# EAGLE design Qwiic Proximity Sensor - VCNL4040 (EAGLE 9.1.0)
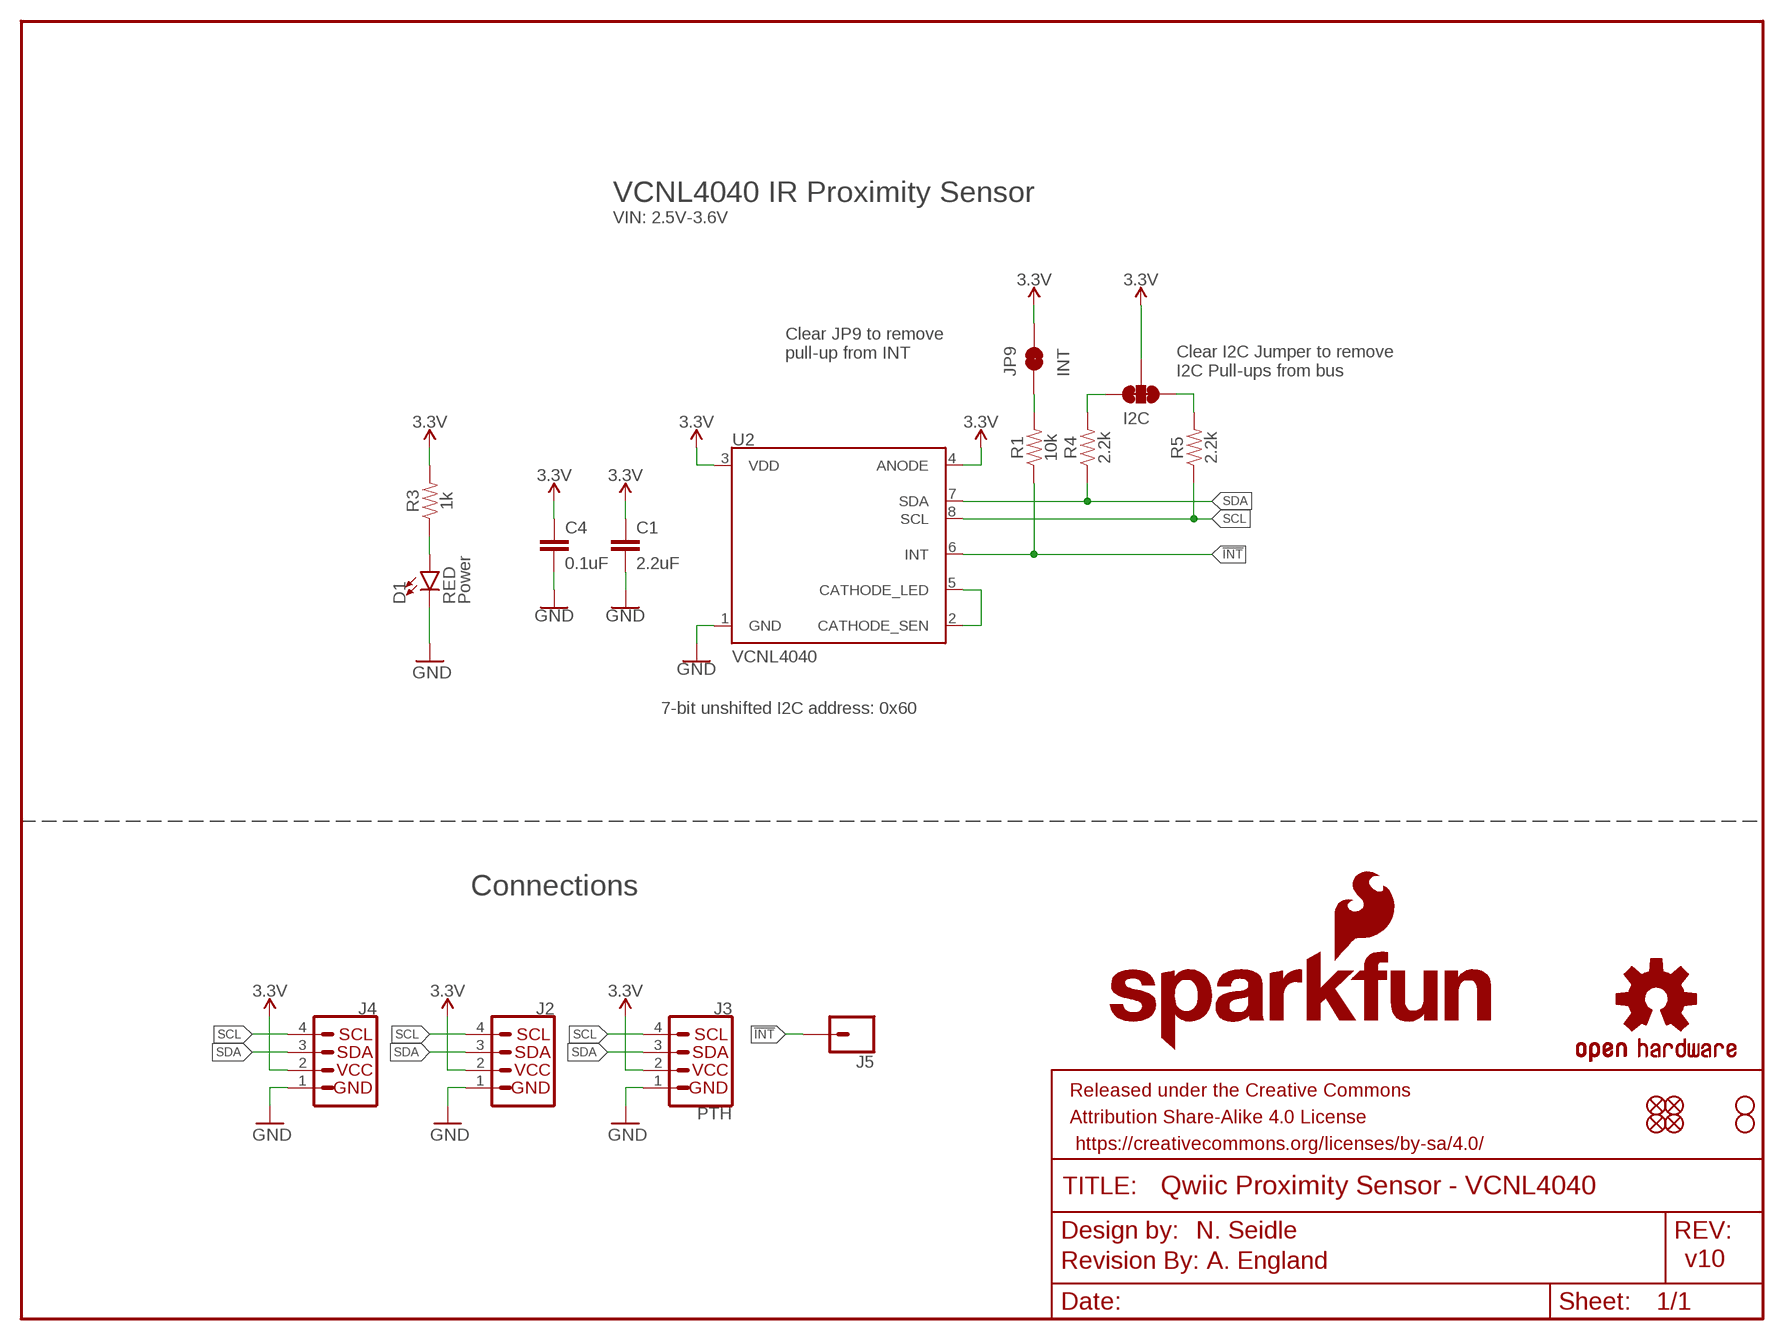
[diagram p0: schematic, sheet 1]

## Parts
C1  2.2uF  2.2UF-0603-10V-20%  [0603]
C4  0.1uF  0.1UF-0603-25V-(+80/-20%)  [0603]
D1  RED  LED-RED0603  [LED-0603]
FRAME1  FRAME-LETTER  [CREATIVE_COMMONS]
I2C  JUMPER-SMT_3_2-NC_TRACE_SILK  [SMT-JUMPER_3_2-NC_TRACE_SILK]
J2  QWIIC_CONNECTORJS-1MM  [1X04_1MM_RA]
J3  PTH  I2C_STANDARD_NO_SILK  [1X04_NO_SILK]
J4  QWIIC_CONNECTORJS-1MM  [1X04_1MM_RA]
J5  CONN_01PTH_NO_SILK_YES_STOP  [1X01_NO_SILK]
JP1  FIDUCIALUFIDUCIAL  [MICRO-FIDUCIAL]
JP2  FIDUCIALUFIDUCIAL  [MICRO-FIDUCIAL]
JP3  STAND-OFF  [STAND-OFF]
JP4  STAND-OFF  [STAND-OFF]
JP5  FIDUCIALUFIDUCIAL  [MICRO-FIDUCIAL]
JP6  FIDUCIALUFIDUCIAL  [MICRO-FIDUCIAL]
JP9  INT  JUMPER-PAD-2-NC_BY_TRACE  [PAD-JUMPER-2-NC_BY_TRACE_YES_SILK]
LOGO1  OSHW-LOGOMINI  [OSHW-LOGO-MINI]
LOGO2  REVISION  [REVISION]
R1  10k  10KOHM-0603-1/10W-1%  [0603]
R3  1k  1KOHM-0603-1/10W-1%  [0603]
R4  2.2k  2.2KOHM-0603-1/10W-1%  [0603]
R5  2.2k  2.2KOHM-0603-1/10W-1%  [0603]
U2  VCNL4040  [SPARKX_VCNL4040]
U$1  SFE_LOGO_NAME_FLAME.1_INCH  [SFE_LOGO_NAME_FLAME_.1]
U$2  SFE_LOGO_NAME_FLAME.1_INCH  [SFE_LOGO_NAME_FLAME_.1]

## Nets
3.3V: C1.1 C4.1 I2C.2 J2.2 J3.2(VCC) J4.2 JP9.2 R3.2 U2.3(VDD) U2.4(ANODE)
!INT: J5.1 R1.1 U2.6(INT)
GND: C1.2 C4.2 D1.C J2.1 J3.1(GND) J4.1 U2.1(GND)
N$1: I2C.1 R5.2
N$2: I2C.3 R4.2
N$3: D1.A R3.1
N$4: JP9.1 R1.2
N$6: U2.2(CATHODE_SEN) U2.5(CATHODE_LED)
SCL: J2.4 J3.4(SCL) J4.4 R5.1 U2.8(SCL)
SDA: J2.3 J3.3(SDA) J4.3 R4.1 U2.7(SDA)

## Notes on the sheet
- VCNL4040 IR Proximity Sensor
- VIN: 2.5V-3.6V
- Clear JP9 to remove 
  pull-up from INT
- Clear I2C Jumper to remove 
  I2C Pull-ups from bus
- Power
- 7-bit unshifted I2C address: 0x60
- Connections
- N. Seidle
- A. England | v10

## Library data of the parts
C1 = SparkFun-Capacitors:2.2UF: 2.2µF ceramic capacitors A capacitor is a passive two-terminal electrical component used to store electrical energy temporarily in an electric field.; PROD_ID: CAP-07888
C4 = SparkFun-Capacitors:0.1UF: 0.1µF ceramic capacitors A capacitor is a passive two-terminal electrical component used to store electrical energy temporarily in an electric field.; PROD_ID: CAP-00810
D1 = SparkFun-LED:LED-RED: Red SMD LED Used in manufacturing of most products at SparkFun Packages: 0603 - SMD 0603 package [Product Link] <http://docs.avagotech.com/docs/AV02-0551EN> 0603 SMART - SMD 0603 SMART package ( more efficient and expensive)[Product Link] <http://www.osram-os.com/Graphics/XPic2/00077099_0.pdf> 1206 - SMD1206 package [Product Link] <https://www.sparkfun.com/datasheets/DevTools/LilyPad/Q150OVS4.pdff> SparkFun Products: Pro Mini 328 -5V <https://www.sparkfun.com/products/821> RedBoard <https://www.sparkfun.com/products/12757> IOIO-OTG <https://www.sparkfun.com/products/13613>; PROD_ID: DIO-00819
FRAME1 = SparkFun-Aesthetics:FRAME-LETTER: Schematic Frame - Letter Standard 8.5x11 US Letter frame
I2C = SparkFun-Jumpers:JUMPER-SMT_3_2-NC_TRACE: Normally closed trace jumper (2 of 2 connections) This jumper has a trace between all three pads so they are normally closed (NC). Use a razor knife to open the connection(s). For best results follow the IPC guidelines for cutting traces: Cutout at least 0.063 mm (0.005 in). Remove all loose material to clean up the cut area. Seal the cut with an approved epoxy. Reapply solder to reclose the connection(s).
J2 J4 = SparkFun-Connectors:QWIIC_CONNECTOR: SparkFun I2C Standard Qwiic Connector An SMD 1mm pitch JST connector makes it easy and quick (get it? Qwiic?) to connect I2C devices to each other. The Qwiic system <http://www.sparkfun.com/qwiic> enables fast and solderless connection between popular platforms and various sensors and actuators. We carry 200mm <https://www.sparkfun.com/products/14204>, 100mm <https://www.sparkfun.com/products/14205>, 50mm <https://www.sparkfun.com/products/14206>, and breadboard friendly <https://www.sparkfun.com/products/14207> Qwiic cables. We also offer 10 pcs strips <https://www.sparkfun.com/products/14323> the SMD connectors.; PROD_ID: CONN-13694
J3 = SparkX:I2C_STANDARD: SparkFun I2C Standard Pinout Header SparkFun has standardized on a pinout for all I2C based sensor breakouts. This pinout allows I2C boards to be plugged directly into the headers on Arduino Uno compatible boards, and to be daisy chained easily. Example SparkFun Products: SparkFun Atmospheric Sensor Breakout - BME280 <https://www.sparkfun.com/products/13676> SparkFun Altitude/Pressure Sensor Breakout - MPL3115A2 <https://www.sparkfun.com/products/11084> SparkFun TOF Range Finder Sensor - VL6180 <https://www.sparkfun.com/products/12785>
J5 = SparkFun-Connectors:CONN_01: Single connection point. Often used as Generic Header-pin footprint for 0.1 inch spaced/style header connections On any of the 0.1 inch spaced packages, you can populate with these: Break Away Headers - Straight <https://www.sparkfun.com/products/116> (PRT-00116) Break Away Male Headers - Right Angle <https://www.sparkfun.com/products/553> (PRT-00553) Female Headers <https://www.sparkfun.com/products/115> (PRT-00115) Break Away Headers - Machine Pin <https://www.sparkfun.com/products/117> (PRT-00117) Break Away Female Headers - Swiss Machine Pin <https://www.sparkfun.com/products/743> (PRT-00743) This device is also useful as a general connection point to wire up your design to another part of your project. Our various solder wires solder well into these plated through hole pads. Hook-Up Wire - Assortment (Stranded, 22 AWG) <https://www.sparkfun.com/products/11375> (PRT-11375) Hook-Up Wire - Assortment (Solid Core, 22 AWG) <https://www.sparkfun.com/products/11367> (PRT-11367) View the entire wire category on our website here <https://www.sparkfun.com/categories/141> Special notes: SMTSO-256-ET is a "flush mount" nut for a 4-40 screw. We mostly use this on specialty testbeds; it is a nice way to connect hardware to your PCB at an adjustable hieght. Also note, the SNAP packages are for using a snappable style connector. We sell a baggie of snaps and they are also used on two LilyPad designs: Snap Assortment - 30 pack (male and female) <https://www.sparkfun.com/products/11347> (DEV-11347) LilyPad Arduino SimpleSnap <https://www.sparkfun.com/products/10941> (DEV-10941) LilyPad SimpleSnap Protoboard <https://www.sparkfun.com/products/10940> (DEV-10940)
JP1 JP2 JP5 JP6 = SparkFun:FIDUCIAL: Fiducial Alignment Points Various fiducial points for machine vision alignment.
JP3 JP4 = SparkFun:STAND-OFF: Stand Off This is the mechanical footprint for a #4 phillips button head screw. Use the keepout ring to avoid running the screw head into surrounding components. SKU : PRT-00447
JP9 = SparkFun-Passives:JUMPER-PAD-2-NC_BY_TRACE
LOGO1 = SparkFun-Aesthetics:OSHW-LOGO: Open-Source Hardware (OSHW) Logo This logo indicates the piece of hardware it is found on incorporates a OSHW license and/or adheres to the definition of open source hardware found here: http://freedomdefined.org/OSHW
LOGO2 = SparkFun-Aesthetics:REVISION: "Revision By" Text Preceding text for revisor documentation. Includes schematic text on "symbols" layer, and board text on tDoc.
R1 = SparkFun-Resistors:10KOHM: 10kΩ resistor A resistor is a passive two-terminal electrical component that implements electrical resistance as a circuit element. Resistors act to reduce current flow, and, at the same time, act to lower voltage levels within circuits. - Wikipedia; PROD_ID: RES-00824
R3 = SparkFun-Resistors:1KOHM: 1kΩ resistor A resistor is a passive two-terminal electrical component that implements electrical resistance as a circuit element. Resistors act to reduce current flow, and, at the same time, act to lower voltage levels within circuits. - Wikipedia; PROD_ID: RES-07856
R4 R5 = SparkFun-Resistors:2.2KOHM: 2.2kΩ resistor A resistor is a passive two-terminal electrical component that implements electrical resistance as a circuit element. Resistors act to reduce current flow, and, at the same time, act to lower voltage levels within circuits. - Wikipedia; PROD_ID: RES-08272
U2 = SparkFun-Sensors:VCNL4040: Vishay VCNL4040 Human Presence sensor A presence sensor with a range of 20 cm. VCNL4040 integrates a proximity sensor (PS), ambient light sensor (ALS), and a high power IRED into one small package.; PROD_ID: IC-14227
U$1 U$2 = SparkFun-Aesthetics:SFE_LOGO_NAME_FLAME: SparkFun Font Logo w/ Flame This is the SparkFun full logo. The logo on the schematic will always be the same size; the package variant is the height of the flame part of the logo. Default layer for the logo on the board is tSilk.

## Net classes
1 power: width 0.203 mm

## Board
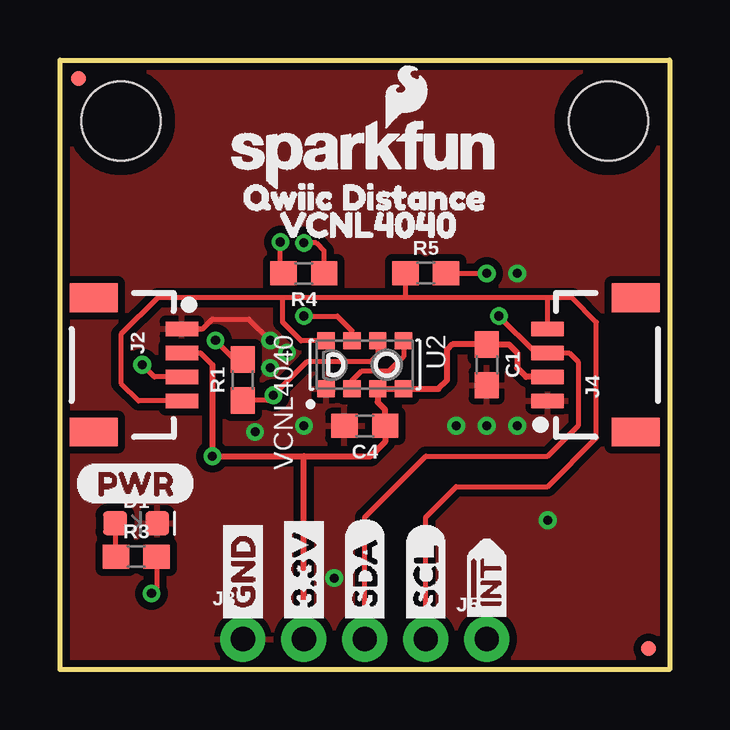
[diagram p1: board, top side]
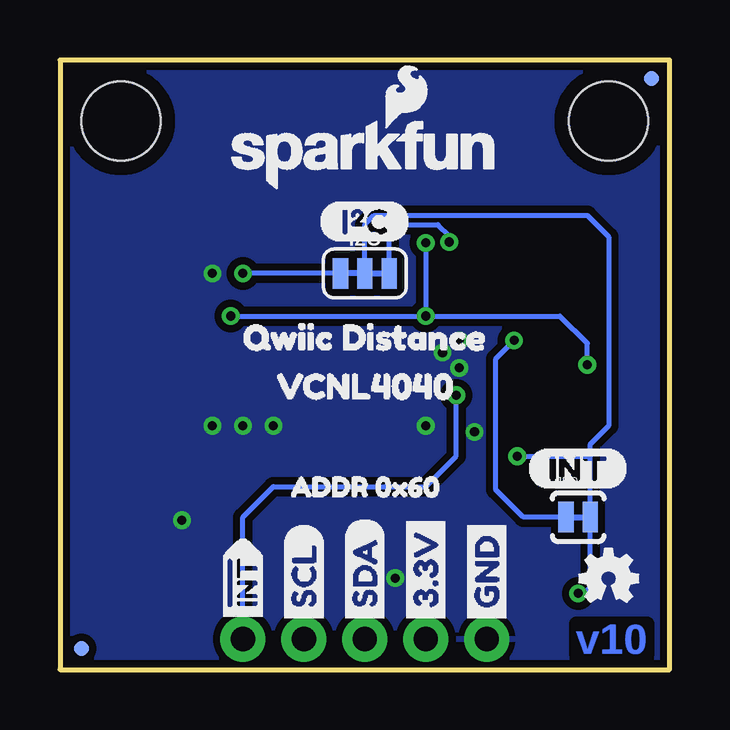
[diagram p2: board, bottom side, seen from below]

Size 25.4 x 25.4 mm. Coordinates in mm from the lower left corner, seen from the top.
Outline: 0,0 0,25.4 25.4,25.4 25.4,0 0,0
Copper layers (1*16): Top 0.035mm / dielectric 1.5mm / Bottom 0.035mm
Design rules "SparkFun-2-layer-TIGHT": minimum track width 7mil, minimum drill 15mil, track to track 7mil, track to pad 7mil, pad to pad 7mil, via to via 7mil, smd to smd 7mil, copper to edge 7mil, drill to drill 7mil, minimum pad ring 7mil, minimum via ring 7mil, stop-mask expansion 4mil, vias tented up to drill 25mil, thermal gap 10mil

### Footprints (pad centres in the part's own frame; a part is rotated, then mirrored left to right if it is on the bottom)
0603 = smd 1.1 x 1: 1 -0.85,0; 2 0.85,0
LED-0603 = smd 1 x 1: A -0.877,0; C 0.877,0
SMT-JUMPER_3_2-NC_TRACE_SILK = smd 0.635 x 1.27: 1 -1.016,0; 2 0,0; 3 1.016,0
1X04_1MM_RA = smd 0.6 x 1.35: 1 -1.5,0; 2 -0.5,0; 3 0.5,0; 4 1.5,0 | smd 1.2 x 2: NC1 2.8,-3.675; NC2 -2.8,-3.675
1X04_NO_SILK = drill 1.016 pad 1.88: 1 0,0; 2 2.54,0; 3 5.08,0; 4 7.62,0
1X01_NO_SILK = drill 1.016 pad 1.88: 1 0,0
MICRO-FIDUCIAL = smd 0.635 x 0.635: 1 0,0
STAND-OFF = hole 3.302: 0,0
PAD-JUMPER-2-NC_BY_TRACE_YES_SILK = smd 0.635 x 1.27: 1 -0.508,0; 2 0.508,0
SPARKX_VCNL4040 = smd 0.7 x 0.725: 1 1,-1.613; 2 1,-0.537; 3 1,0.537; 4 1,1.613; 5 -1,1.613; 6 -1,0.537; 7 -1,-0.537; 8 -1,-1.613

### Placement (x,y rotation side)
C1  17.78,12.7 270 top
C4  12.7,10.16 180 top
D1  3.17,6.1 0 top
FRAME1  -20.32,-17.78 0 top  (outside the outline)
I2C  12.7,16.51 0 bottom
J2  5.08,12.7 270 top
J3  7.62,1.27 0 top
J4  20.32,12.7 90 top
J5  17.78,1.27 0 top
JP1  0.76,24.64 0 bottom
JP2  24.51,0.89 0 top
JP3  2.54,22.86 0 top
JP4  22.86,22.86 0 top
JP5  24.51,0.89 0 bottom
JP6  0.76,24.64 0 top
JP9  3.81,6.35 0 bottom
LOGO1  2.54,3.81 0 bottom
LOGO2  -8.89,-20.32 0 top  (outside the outline)
R1  7.62,12.06 90 top
R3  3.17,4.7 0 top
R4  10.16,16.51 180 top
R5  15.24,16.51 0 top
U2  12.7,12.7 270 top
U$1  12.7,21.46 0 top
U$2  12.7,21.46 0 bottom
U$3  [GND1]  7.62,1.65 90 bottom
U$4  [3#3V2]  10.16,1.65 90 bottom
U$5  [SDA8]  12.7,1.65 90 bottom
U$6  [SCL9]  15.24,1.65 90 bottom
U$7  [#INT14]  17.78,1.52 90 bottom
U$8  [ADDR_0X600]  16.51,7.62 0 bottom
U$10  [(PWR)]  0.64,7.75 0 top
U$11  [(I_SUPER2_C)]  14.61,18.67 0 bottom
U$12  [(INT)]  5.97,8.38 0 bottom
U$13  [VCNL40401]  8.26,18.54 0 top
U$14  [VCNL40401]  17.27,11.81 0 bottom
U$15  [QWIIC_DISTANCE0]  18.67,13.84 0 bottom
U$19  [QWIIC_DISTANCE0]  6.73,19.68 0 top
U$21  [3#3V2]  10.16,1.65 90 top
U$22  [GND1]  7.62,1.65 90 top
U$25  [#INT14]  17.78,1.52 90 top
U$26  [SCL9]  15.24,1.65 90 top
U$27  [SDA8]  12.7,1.65 90 top

### Tracks (layer width: path | path; a pad name or v marks a point on that pad's centre or on a via)
3.3V  (via drill 0.38)
  Top 0.203: J2.2 5.85,13.2 6.35,12.7 | R3.2 4.03,3.39 v3.81,3.17
  Top 0.254: J4.2 19.42,12.2 19.05,12.57 19.05,13.21 18.71,13.55 C1.1 16.34,13.55 16.13,13.34 16.13,12.06 15.76,11.7 U2.4 U2.3 13.24,11.15 13.55,10.83 C4.1 13.55,9.49 12.95,8.89 10.16,8.89 | 6.35,12.7 v6.35,8.89 10.16,8.89 | J3.2 10.16,8.89
  Bottom 0.203: 3.3,8.89 JP9.2 3.3,3.43 3.56,3.17 v3.81,3.17 | 3.3,8.89 3.3,9.4 2.54,10.16 2.54,18.03 3.43,18.92 12.32,18.92 12.7,18.54 I2C.2 | v6.35,8.89 3.3,8.89
!INT  (via drill 0.38)
  Top 0.203: 7.91,11.21 R1.1 8.68,11.21 v8.89,11.43 10.29,12.83 12.95,12.83 13.24,13.11 U2.6
  Bottom 0.203: J5.1 17.78,6.35 16.51,7.62 10.16,7.62 8.89,8.89 v8.89,11.43
GND  (via drill 0.38)
  Top 0.203: J2.1 5.95,14.2 6.35,14.61 7.87,14.61 v8.76,13.72
  other vias: 17.78,10.16 11.43,3.81 19.05,16.51 10.16,10.16 20.32,6.22 8.13,9.91 8.76,12.57 9.46,13.21 16.51,10.16 19.05,10.16
  pour Bottom (isolate 0.305): 0,0 0,25.4 25.4,25.4 25.4,0
  pour Top (isolate 0.305): 0,0 0,25.4 25.4,25.4 25.4,0
N$1  (via drill 0.38)
  Top 0.203: R5.2 v17.78,16.51
  Bottom 0.203: I2C.1 17.7,16.51 v17.78,16.51
N$2  (via drill 0.38)
  Top 0.203: v9.18,17.82 9.18,16.64 R4.2
  Bottom 0.203: I2C.3 11.68,18.16 11.3,18.54 9.65,18.54 9.18,18.07 v9.18,17.82
N$3
  Top 0.203: D1.A 2.3,4.73 R3.1
N$4  (via drill 0.38)
  Top 0.203: R1.2 7.28,12.91 v6.48,13.72
  Bottom 0.203: v6.48,13.72 7.24,12.95 7.24,7.49 6.1,6.35 JP9.1
N$6
  Top 0.203: U2.5 14.31,13.04 13.72,12.45 12.57,12.45 12.16,12.04 U2.2
SCL
  Top 0.203: 14.39,15.49 13.34,15.49 9.27,15.49 | 9.27,15.49 4.06,15.49 2.54,13.97 2.54,11.94 3.28,11.2 J2.4 | J3.4 15.24,6.35 16.51,7.62 20.32,7.62 22.35,9.65 22.35,14.48 21.34,15.49 20.32,15.49 | U2.8 10.05,13.7 9.27,14.48 9.27,15.24 9.27,15.37 9.27,15.49 | R5.1 14.39,15.49 | 20.32,15.49 14.39,15.49 | J4.4 20.32,15.49
SDA  (via drill 0.38)
  Top 0.203: v18.29,14.73 19.82,13.2 J4.3 21.22,13.2 21.59,12.83 21.59,10.16 20.32,8.89 15.24,8.89 12.7,6.35 J3.3 | J2.3 3.93,12.2 v3.43,12.7 | R4.1 11.01,17.44 10.67,17.78 v10.16,17.78 | v10.16,14.73 11.56,14.73 12.16,14.13 U2.7
  Bottom 0.203: v3.43,12.7 3.43,13.59 4.57,14.73 v10.16,14.73 | v18.29,14.73 v10.16,14.73 | v10.16,17.78 v10.16,14.73

### Text on the board
Bottom: v10
tDocu: Nathan Seidle | Andy England